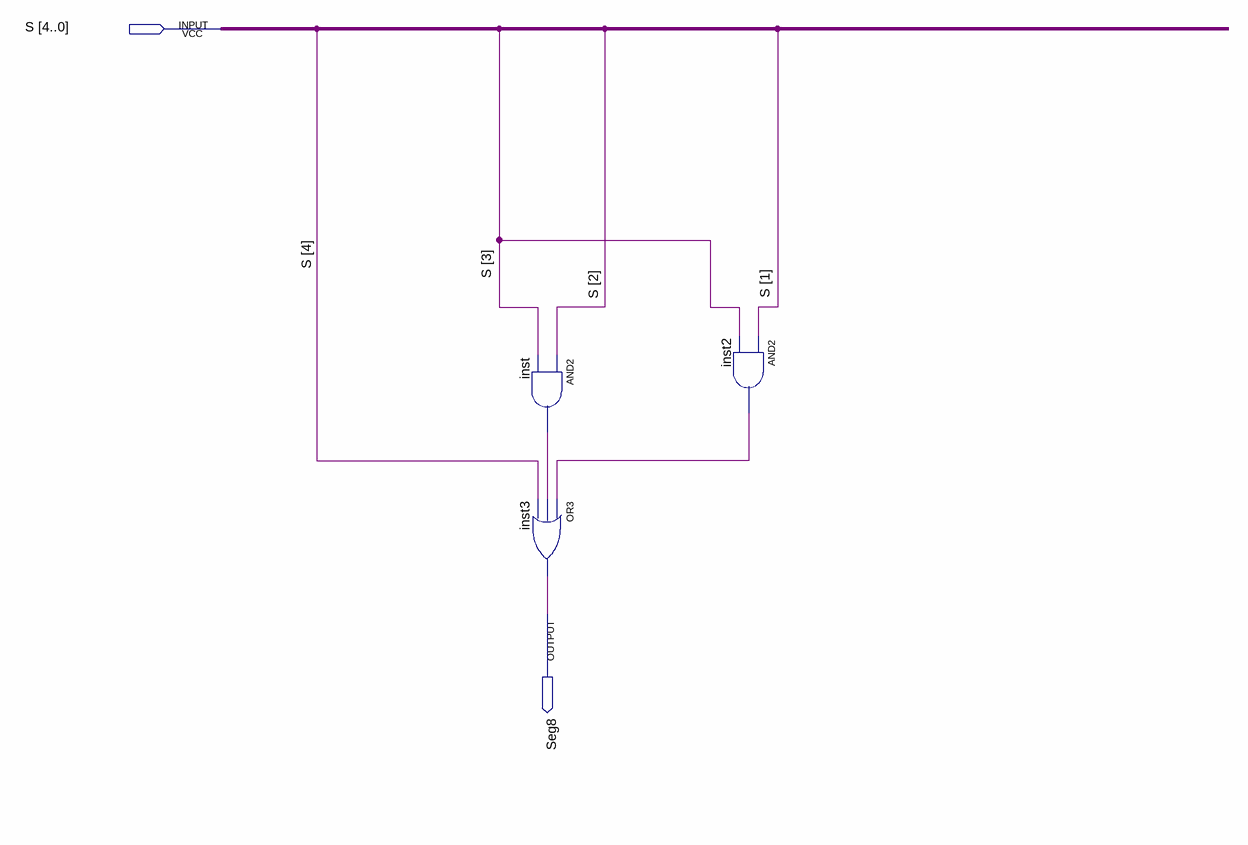
[diagram p0: schematic sheet]
// Quartus schematic Seg8.bdf as structural Verilog: 3 symbols, 2 pins
module Seg8 (
  input  [4:0] S,
  output Seg8
);

  wire inst2_out, inst_out;

  and inst (inst_out, S[2], S[3]);
  or inst3 (Seg8, inst2_out, inst_out, S[4]);
  and inst2 (inst2_out, S[1], S[3]);
endmodule
